# Altium schematic sheet Speaker.SchDoc
size A
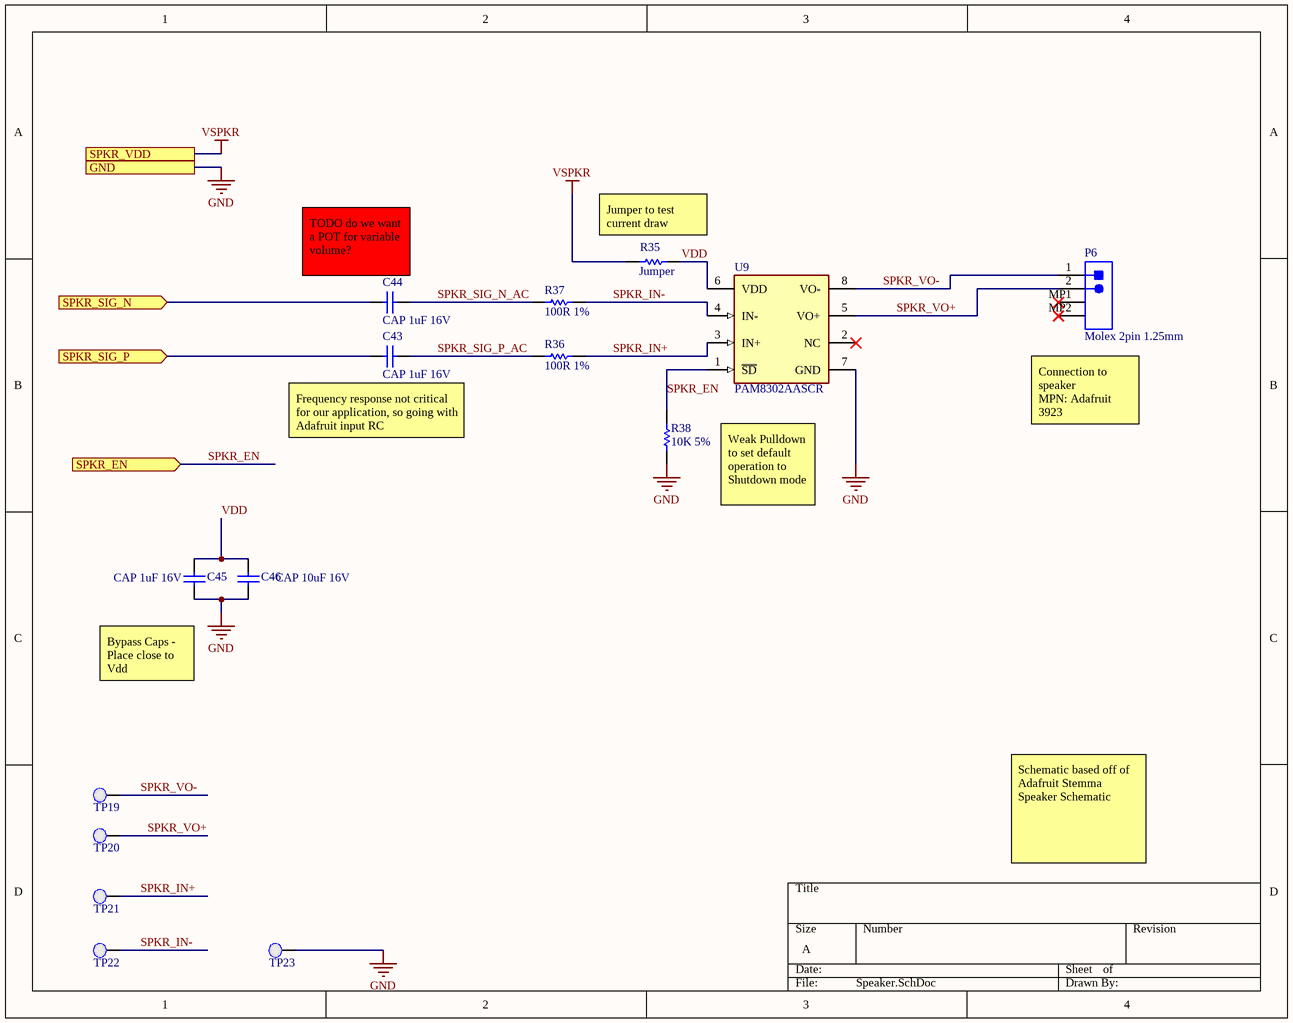
[diagram p0: Speaker.SchDoc]

## Parts
C43  CAP 1uF 16V  [CAPC0402(1005)60_M]
C44  CAP 1uF 16V  [CAPC0402(1005)60_M]
C45  CAP 1uF 16V  [CAPC0402(1005)60_M]
C46  CAP 10uF 16V  [CAPC0805(2012)145_L]
P6  Molex 2pin 1.25mm  [MOLX-53261-0271_V]
R35  Jumper  [RESC0805(2012)_N]
R36  100R 1%  [RESC0402(1005)_N]
R37  100R 1%  [RESC0402(1005)_N]
R38  10K 5%  [RESC0402(1005)_N]
TP19  0.1" Pad  [PCBComponent]  (value not drawn)
TP20  0.1" Pad  [PCBComponent]  (value not drawn)
TP21  0.1" Pad  [PCBComponent]  (value not drawn)
TP22  0.1" Pad  [PCBComponent]  (value not drawn)
TP23  0.1" Pad  [PCBComponent]  (value not drawn)
U9  PAM8302AASCR  [FP-MSOP-8-MFG]

## Ports
GND, SPKR_EN (in), SPKR_SIG_N (in), SPKR_SIG_P (in), SPKR_VDD

## Nets
GND: C45.1 C46.1 R38.1 TP23.1(PAD) U9.7(GND) ; port GND
VSPKR: R35.1 ; port SPKR_VDD
SPKR_EN: R38.2 U9.1(~{SD}) ; port SPKR_EN
SPKR_IN+: R36.2 TP21.1(PAD) U9.3(IN+)
SPKR_IN-: R37.2 TP22.1(PAD) U9.4(IN-)
SPKR_SIG_N: C44.2 ; port SPKR_SIG_N
SPKR_SIG_N_AC: C44.1 R37.1
SPKR_SIG_P: C43.2 ; port SPKR_SIG_P
SPKR_SIG_P_AC: C43.1 R36.1
SPKR_VO+: P6.2 TP20.1(PAD) U9.5(VO+)
SPKR_VO-: P6.1 TP19.1(PAD) U9.8(VO-)
VDD: C45.2 C46.2 R35.2 U9.6(VDD)

Not connected (* = marked no-connect by the designer): P6 MP1* MP2*; U9 2(NC)*

## Notes on the sheet
- (near R35) Jumper to test current draw
- (near C44) TODO do we want a POT for variable volume?
- (near C43) Frequency response not critical for our application, so going with Adafruit input RC
- (near P6) Connection to  speaker
  MPN: Adafruit 3923
- Weak Pulldown to set default operation to Shutdown mode
- (near C45) Bypass Caps - Place close to Vdd
- Schematic based off of Adafruit Stemma Speaker Schematic

## Library data of the parts
C43-C45 = CMP-1034-02119-1: CAP 1uF 16V ±10% 0402 (1005 Metric) Thickness 0.6mm SMD; Case-EIA: 0402; Tolerance: Â±10%; Case-Metric: 1005; Technology: SMT; Rated Voltage: 16 V; Max Thickness: 0.6 mm; Value: 1uF
C46 = CMP-1036-04927-1: CAP 10uF 16V ±10% 0805 (2012 Metric) Thickness 1.45mm SMD; Case-EIA: 0805; Tolerance: Â±10%; Case-Metric: 2012; Rated Voltage: 16 V; Technology: SMT; Value: 10uF; Max Thickness: 1.45 mm
P6 = CMP-2000-05633-1: PicoBlade(TM) Header, Right Angle, -40 to 85 degC, 2-Pin SMD, RoHS, Tape and Reel; Current - Max: 1A; Voltage Rating: 125V; Number of Positions: 2; Package Version: Rev. H, 11/2014; Factory Pack Quantity: 1000; Datasheet URL: http://www.molex.com/webdocs/datasheets/pdf/en-us/0532610271_PCB_HEADERS.pdf; Datasheet Version: 03/2016; Housing Material: Thermoplastic; RoHS: Details; Product Type: Headers; Number of Rows: 1; Termination Style: SMD; Brand: Molex; Mounting Technology: SurfaceMount; Number of Positions / Contacts: 2; Package URL: http://www.molex.com/pdm_docs/sd/532610271_sd.pdf; Mounting Angle: Right; Mounting Style: SMD/SMT; Manufacturer: Molex; Product Category: 1.25mmConnectors; Tradename: PicoBlade; Voltage - Max: 125V; Manufacturer URL: http://www.molex.com/; Series: 53261; Package Description: 2-Leads Header, Pitch 1.25 mm, Mated Height 3.4 mm; Package Reference: 53261-0271; Current Rating: 1A; Contact Plating: Tin; Pitch: 1.25mm; Contact Material: PhosphorBronze; Type: Shrouded; Packaging: Reel
R35 = CMP-1013-00001-1: Jumper 0805 (2012 Metric); Case-EIA: 0805; Value: 0.00 Ohm; Tolerance: None; Case-Metric: 2012; Technology: SMT; Power: None
R36 R37 = CMP-1011-00397-1: 100R 0.063W 1% 0402 (1005 Metric)  SMD; Case-EIA: 0402; Case-Metric: 1005; Value: 100.00 Ohm; Technology: SMT; Tolerance: 1 %; Power: 0.063 W
R38 = CMP-1011-00098-1: 10K 0.063W 5% 0402 (1005 Metric)  SMD; Case-Metric: 1005; Value: 10000.00 Ohm; Case-EIA: 0402; Technology: SMT; Tolerance: 5 %; Power: 0.063 W
TP19-TP23 = 0.1" Pad-A.4
U9 = CMP-12733-000002-1: IC AMP CLASS D MONO 2.5W 8MSOP; Manufacturer: Diodes Inc.; Nominal Supply Current: 4mA; Number Of Channels: 1; Max Junction Temp: +125°C; Min Supply Voltage: 2V; Power At Speaker R: 2.5W @ 4Ω; Max Supply Voltage: 5.5V; Voltage Gain: 24dB; Standoff Height: 0.05mm; Manufacturer Part Number: PAM8302AASCR; ComponentLink2URL: https://www.diodes.com/assets/Datasheets/PAM8302A.pdf; Mouser Description: Audio Amplifiers 2.5W MONO FILTERLESS CLASS-D AUDIO AMP; ComponentLink2Description: Datasheet; Temperature: -40°C to +85°C; Automotive: No; Footprint Url: https://www.diodes.com/assets/Package-Files/MSOP-8.pdf; Device Class L1: Integrated Circuits (ICs); Temperature Range Low: -40°C; Temperature Range High: +85°C; Lead Free: Yes; Package: MSOP-8; Height: 1.1mm; Category: IC; Ipc Land Pattern Name: SOP65P490X110-8; Octopart: https://octopart.com/pam8302aascr-diodes+inc.-29030473; RoHS: TRUE; Device Class L3: Amplifiers - Audio; Device Class L2: Linear ICs; Digikey Description: IC AMP CLASS D MONO 2.5W 8MSOP